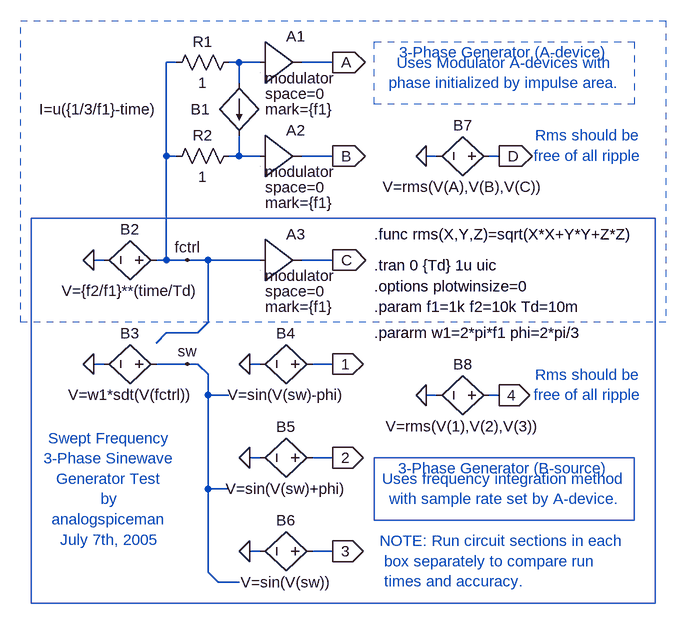
[diagram p0: schematic Swept_Sine_3_Phase.asc]
Swept_Sine_3_Phase.asc, the LTspice schematic file:
Version 4
SHEET 1 880 788
WIRE -704 160 -720 160
WIRE -704 320 -720 320
WIRE -608 0 -608 -144
WIRE -608 160 -624 160
WIRE -608 160 -608 0
WIRE -608 272 -624 288
WIRE -592 -144 -608 -144
WIRE -592 0 -608 0
WIRE -576 160 -608 160
WIRE -576 320 -624 320
WIRE -560 272 -608 272
WIRE -560 320 -576 320
WIRE -544 160 -576 160
WIRE -544 256 -560 272
WIRE -544 256 -544 160
WIRE -544 336 -560 320
WIRE -544 368 -544 336
WIRE -544 512 -544 368
WIRE -544 640 -544 512
WIRE -528 656 -544 640
WIRE -512 368 -544 368
WIRE -512 512 -544 512
WIRE -496 -144 -512 -144
WIRE -496 -112 -496 -144
WIRE -496 0 -512 0
WIRE -496 0 -496 -32
WIRE -496 656 -528 656
WIRE -464 -144 -496 -144
WIRE -464 0 -496 0
WIRE -464 160 -544 160
WIRE -464 320 -480 320
WIRE -464 464 -480 464
WIRE -464 608 -480 608
WIRE -352 -144 -400 -144
WIRE -352 0 -400 0
WIRE -352 160 -400 160
WIRE -352 320 -384 320
WIRE -352 464 -384 464
WIRE -352 608 -384 608
WIRE -192 0 -208 0
WIRE -192 368 -208 368
WIRE -96 0 -112 0
WIRE -96 368 -112 368
FLAG -352 0 B
IOPIN -352 0 Out
FLAG -352 160 C
IOPIN -352 160 Out
FLAG -352 -144 A
IOPIN -352 -144 Out
FLAG -576 160 fctrl
FLAG -720 160 0
FLAG -480 320 0
FLAG -352 320 1
IOPIN -352 320 Out
FLAG -480 464 0
FLAG -352 464 2
IOPIN -352 464 Out
FLAG -480 608 0
FLAG -352 608 3
IOPIN -352 608 Out
FLAG -720 320 0
FLAG -576 320 sw
FLAG -96 0 D
IOPIN -96 0 Out
FLAG -208 0 0
FLAG -96 368 4
IOPIN -96 368 Out
FLAG -208 368 0
SYMBOL res -496 -160 R90
WINDOW 0 0 56 VBottom 0
WINDOW 3 32 56 VTop 0
SYMATTR InstName R1
SYMATTR Value 1
SYMBOL res -608 16 R270
WINDOW 0 32 56 VTop 0
WINDOW 3 0 56 VBottom 0
SYMATTR InstName R2
SYMATTR Value 1
SYMBOL bi -496 -112 M0
WINDOW 0 45 40 Left 0
WINDOW 3 125 40 Left 0
SYMATTR InstName B1
SYMATTR Value I=u({1/3/f1}-time)
SYMBOL bv -608 160 M270
WINDOW 0 32 56 VTop 0
WINDOW 3 -32 56 VBottom 0
SYMATTR InstName B2
SYMATTR Value V={f2/f1}**(time/Td)
SYMBOL Digital\\buf1 -464 -208 R0
WINDOW 3 8 112 Left 0
WINDOW 38 8 88 Left 0
WINDOW 123 8 136 Left 0
SYMATTR Value space=0
SYMATTR SpiceModel modulator
SYMATTR Value2 mark={f1}
SYMATTR InstName A1
SYMBOL Digital\\buf1 -464 -64 R0
WINDOW 3 8 112 Left 0
WINDOW 38 8 88 Left 0
WINDOW 123 8 136 Left 0
SYMATTR Value space=0
SYMATTR SpiceModel modulator
SYMATTR Value2 mark={f1}
SYMATTR InstName A2
SYMBOL Digital\\buf1 -464 96 R0
WINDOW 3 8 112 Left 0
WINDOW 38 8 88 Left 0
WINDOW 123 8 136 Left 0
SYMATTR Value space=0
SYMATTR SpiceModel modulator
SYMATTR Value2 mark={f1}
SYMATTR InstName A3
SYMBOL bv -368 320 R90
WINDOW 0 -32 56 VBottom 0
WINDOW 3 32 56 VTop 0
WINDOW 123 60 56 VTop 0
SYMATTR InstName B4
SYMATTR Value V=sin(V(sw)-phi)
SYMBOL bv -368 464 R90
WINDOW 0 -32 56 VBottom 0
WINDOW 3 32 56 VTop 0
WINDOW 123 60 56 VTop 0
SYMATTR InstName B5
SYMATTR Value V=sin(V(sw)+phi)
SYMBOL bv -368 608 R90
WINDOW 0 -32 56 VBottom 0
WINDOW 3 32 56 VTop 0
WINDOW 123 60 56 VTop 0
SYMATTR InstName B6
SYMATTR Value V=sin(V(sw))
SYMBOL bv -96 0 R90
WINDOW 0 -32 56 VBottom 0
WINDOW 3 32 56 VTop 0
SYMATTR InstName B7
SYMATTR Value V=rms(V(A),V(B),V(C))
SYMBOL bv -96 368 R90
WINDOW 0 -32 56 VBottom 0
WINDOW 3 32 56 VTop 0
SYMATTR InstName B8
SYMATTR Value V=rms(V(1),V(2),V(3))
SYMBOL bv -608 320 M270
WINDOW 0 32 56 VTop 0
WINDOW 3 -32 56 VBottom 0
SYMATTR InstName B3
SYMATTR Value V=w1*sdt(V(fctrl))
TEXT -288 200 Left 0 !.options plotwinsize=0
TEXT -288 168 Left 0 !.tran 0 {Td} 1u uic
TEXT -288 232 Left 0 !.param f1=1k f2=10k Td=10m
TEXT -288 272 Left 0 !.pararm w1=2*pi*f1 phi=2*pi/3
TEXT -288 120 Left 0 !.func rms(X,Y,Z)=sqrt(X*X+Y*Y+Z*Z)
TEXT -88 -160 Center 0 ;3-Phase Generator (A-device)
TEXT -88 -128 Center 0 ;Uses Modulator A-devices with\nphase initialized by impulse area.
TEXT -88 480 Center 0 ;3-Phase Generator (B-source)
TEXT -88 512 Center 0 ;Uses frequency integration method\nwith sample rate set by A-device.
TEXT 40 -16 Center 0 ;Rms should be\nfree of all ripple
TEXT 40 352 Center 0 ;Rms should be\nfree of all ripple
TEXT -280 592 Left 0 ;NOTE: Run circuit sections in each\n box separately to compare run\n times and accuracy.
TEXT -696 512 Center 0 ;Swept Frequency\n3-Phase Sinewave\nGenerator Test\nby\nanalogspiceman\nJuly 7th, 2005
RECTANGLE Normal 160 256 -832 -208 2
RECTANGLE Normal 144 688 -816 96
RECTANGLE Normal 112 -80 -288 -176 2
RECTANGLE Normal 112 560 -288 464

The netlist it stands for:
* Swept_Sine_3_Phase.asc
R1 N001 fctrl 1
R2 fctrl N002 1
B1 N001 N002 I=u({1/3/f1}-time)
B2 fctrl 0 V={f2/f1}**(time/Td)
A1 N001 0 0 0 0 0 A 0 modulator space=0 mark={f1}
A2 N002 0 0 0 0 0 B 0 modulator space=0 mark={f1}
A3 fctrl 0 0 0 0 0 C 0 modulator space=0 mark={f1}
B4 1 0 V=sin(V(sw)-phi)
B5 2 0 V=sin(V(sw)+phi)
B6 3 0 V=sin(V(sw))
B7 D 0 V=rms(V(A),V(B),V(C))
B8 4 0 V=rms(V(1),V(2),V(3))
B3 sw 0 V=w1*sdt(V(fctrl))
.options plotwinsize=0
.tran 0 {Td} 1u uic
.param f1=1k f2=10k Td=10m
.pararm w1=2*pi*f1 phi=2*pi/3
.func rms(X,Y,Z)=sqrt(X*X+Y*Y+Z*Z)
* 3-Phase Generator (A-device)
* Uses Modulator A-devices with
* phase initialized by impulse area.
* 3-Phase Generator (B-source)
* Uses frequency integration method
* with sample rate set by A-device.
* Rms should be
* free of all ripple
* Rms should be
* free of all ripple
* NOTE: Run circuit sections in each
*  box separately to compare run
*  times and accuracy.
* Swept Frequency
* 3-Phase Sinewave
* Generator Test
* by
* analogspiceman
* July 7th, 2005
.backanno
.end